# EAGLE schematic bottlenose (EAGLE 6.4)
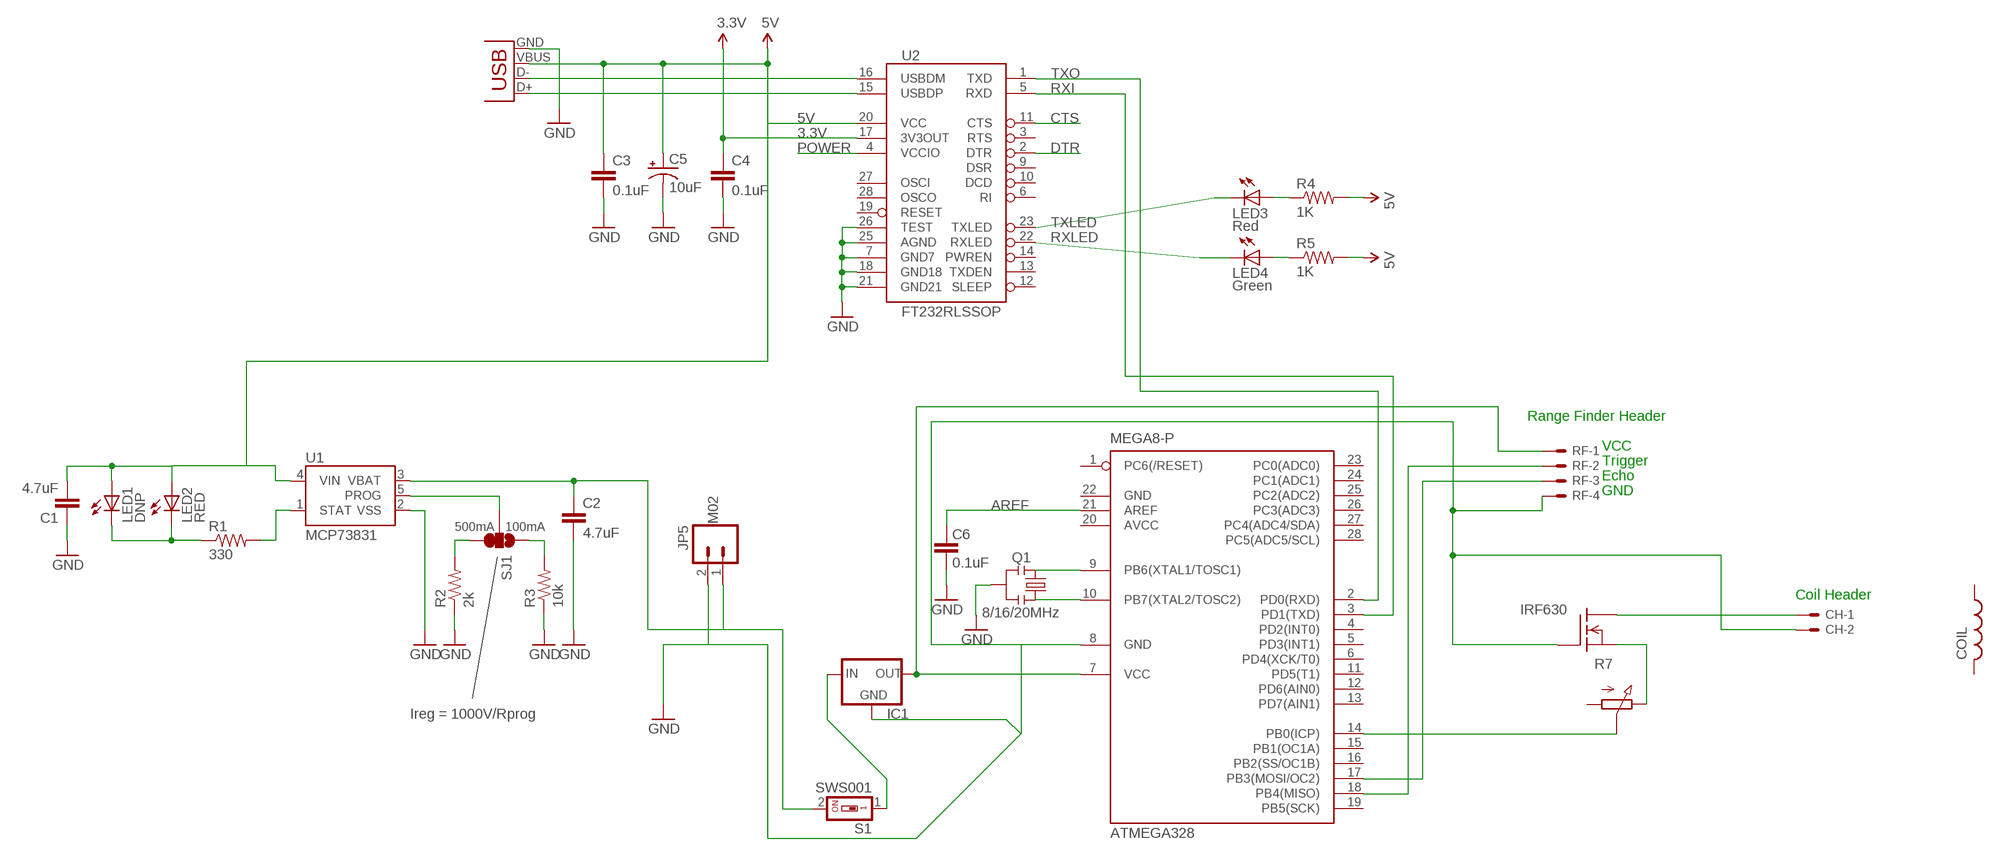
[diagram p0: schematic, sheet 1]

## Parts
ATMEGA328  MEGA8-P  [DIL28-3]
C1  4.7uF  CAP0402-CAP  [0402-CAP]
C2  4.7uF  CAP0402-CAP  [0402-CAP]
C3  0.1uF  CAP0402-CAP  [0402-CAP]
C4  0.1uF  CAP0402-CAP  [0402-CAP]
C5  10uF  CAP_POL1206  [EIA3216]
C6  0.1uF  CAP0402-CAP  [0402-CAP]
CH  22-23-2021  [22-23-2021]
COIL  L-US0204/7  [0204/7]
IC1  78LXX  [78LXX]
IRF630  IRF620  [TO220]
JP5  M02  M02PTH  [1X02]
LED1  DNP  LED3MM  [LED3MM]
LED2  RED  LED0603  [LED-0603]
LED3  Red  LED0603  [LED-0603]
LED4  Green  LED0603  [LED-0603]
Q1  8/16/20MHz  RESONATORSMD  [RESONATOR-SMD]
R1  330  RESISTOR0402-RES  [0402-RES]
R2  2k  RESISTOR0402-RES  [0402-RES]
R3  10k  RESISTOR0402-RES  [0402-RES]
R4  1K  RESISTOR0402-RES  [0402-RES]
R5  1K  RESISTOR0402-RES  [0402-RES]
R7  PC25  [PC25]
RF  22-23-2041  [22-23-2041]
S1  SWS001  [SMS-001]
SJ1  SOLDERJUMPER_2WAYS  [SJ_3]
U1  MCP73831  [SOT23-5]
U2  FT232RLSSOP  [SSOP28DB]
X1  USB-SMD-NS  [USB-MINIB-NOSTOP]

## Nets
3.3V [power]: C4.1 U2.17(3V3OUT)
5V: C1.2 C3.1 C5.A(+) LED1.A LED2.A R4.2 R5.2 U1.4(VIN) U2.20(VCC) X1.VBUS
AREF: ATMEGA328.21(AREF) C6.2
CTS: U2.11(CTS)
DTR: U2.2(DTR)
GND: ATMEGA328.8(GND) C1.1 C2.2 C3.2 C4.2 C5.C(-) C6.1 CH.2 IC1.GND IRF630.1(G) JP5.2 Q1.2 R2.1 R3.1 RF.4 U1.2(VSS) U2.7(GND7) U2.18(GND18) U2.21(GND21) U2.25(AGND) U2.26(TEST) X1.GND
N$1: IRF630.3(S) R7.E
N$2: R1.2 U1.1(STAT)
N$3: LED1.K(C) LED2.C R1.1
N$4: R2.2 SJ1.3
N$5: IC1.IN S1.1
N$7: R3.2 SJ1.1
N$8: ATMEGA328.17(PB3(MOSI/OC2)) RF.3
N$9: ATMEGA328.18(PB4(MISO)) RF.2
N$10: ATMEGA328.14(PB0(ICP)) R7.S
N$11: CH.1 IRF630.2(D)
N$12: ATMEGA328.10(PB7(XTAL2/TOSC2)) Q1.1
N$13: ATMEGA328.9(PB6(XTAL1/TOSC1)) Q1.3
N$15: LED3.A R4.1
N$16: LED4.A R5.1
N$35: ATMEGA328.7(VCC) IC1.OUT RF.1
POWER: U2.4(VCCIO)
PROG: SJ1.2 U1.5(PROG)
RXI: ATMEGA328.3(PD1(TXD)) U2.5(RXD)
RXLED: LED4.C U2.22(RXLED)
TXLED: LED3.C U2.23(TXLED)
TXO: ATMEGA328.2(PD0(RXD)) U2.1(TXD)
USB_D+: U2.15(USBDP) X1.D+
USB_D-: U2.16(USBDM) X1.D-
VBAT: C2.1 JP5.1 S1.2 U1.3(VBAT)
Unconnected: ATMEGA328.1(PC6(/RESET)) ATMEGA328.4(PD2(INT0)) ATMEGA328.5(PD3(INT1)) ATMEGA328.6(PD4(XCK/T0)) ATMEGA328.11(PD5(T1)) ATMEGA328.12(PD6(AIN0)) ATMEGA328.13(PD7(AIN1)) ATMEGA328.15(PB1(OC1A)) ATMEGA328.16(PB2(SS/OC1B)) ATMEGA328.19(PB5(SCK)) ATMEGA328.23(PC0(ADC0)) ATMEGA328.24(PC1(ADC1)) ATMEGA328.25(PC2(ADC2)) ATMEGA328.26(PC3(ADC3)) ATMEGA328.27(PC4(ADC4/SDA)) ATMEGA328.28(PC5(ADC5/SCL)) COIL.1 COIL.2 R7.A U2.3(RTS) U2.6(RI) U2.9(DSR) U2.10(DCD) U2.12(SLEEP) U2.13(TXDEN) U2.14(PWREN) U2.19(RESET) U2.27(OSCI) U2.28(OSCO)

## Notes on the sheet
- Range Finder Header
- VCC
- Trigger
- Echo
- GND
- 500mA | 100mA
- Coil Header
- Ireg = 1000V/Rprog

## Power pins joined to a net without a drawn wire
AVCC: ATMEGA328.20(AVCC)
GND: ATMEGA328.22(GND)

## Library data of the parts
ATMEGA328 = atmel:MEGA8-P: MICROCONTROLLER 8 Kbytes FLASH, 1 kbytes SRAM, 512 bytes EEPROM, USART, 4-channel 10 bit ADC, 2-channel 8 bit ADC Pin compatible with Atmega48, ATMega88, ATMega168 Source: avr.lbr; OC_FARNELL: unknown; OC_NEWARK: unknown
C1-C4 C6 = SparkFun:CAP: Capacitor Standard 0603 ceramic capacitor, and 0.1" leaded capacitor.
C5 = SparkFun:CAP_POL: Capacitor Polarized These are standard SMD and PTH capacitors. Normally 10uF, 47uF, and 100uF in electrolytic and tantalum varieties. Always verify the external diameter of the through hole cap, it varies with capacity, voltage, and manufacturer. The EIA devices should be standard.
CH = con-molex:22-23-2021: .100" (2.54mm) Center Header - 2 Pin; MF: MOLEX; MPN: 22-23-2021; OC_FARNELL: 1462926; OC_NEWARK: 25C3832
COIL = rcl:L-US: INDUCTOR, American symbol
IC1 = v-reg:78LXX: VOLTAGE REGULATOR
IRF630 = transistor-fet:IRF620: N-Channel Enhancement MOSFET (HEXFET); 200V; 5,2A; 0,8Ohm
JP5 = SparkFun:M02: Header 2 Standard 2-pin 0.1" header. Use with straight break away headers (SKU : PRT-00116), right angle break away headers (PRT-00553), swiss pins (PRT-00743), machine pins (PRT-00117), and female headers (PRT-00115). Molex polarized connector foot print use with SKU : PRT-08233 with associated crimp pins and housings.
LED1-LED4 = SparkFun:LED: LEDs Standard schematic elements and footprints for 5mm, 3mm, 1206, and 0603 sized LEDs. 5mm - Spark Fun Electronics SKU : COM-00529 (and others)
Q1 = SparkFun:RESONATOR: Resonator Small SMD resonator. This is the itty bitty 10/20MHz resonators with built in caps. CSTCE10M0G55 and CSTCE20M0V53. Footprint has been reviewed closely but hasn't been tested yet.
R1-R5 = SparkFun:RESISTOR: Resistor Basic schematic elements and footprints for 0603, 1206, and PTH resistors.
R7 = pot-vitrohm:PC25: VITROHM POTENTIOMETER; MF: CLAROSTAT; MPN: 308NPC25KS; OC_FARNELL: 1440998; OC_NEWARK: 03F7518
RF = con-molex:22-23-2041: .100" (2.54mm) Center Header - 4 Pin; MF: MOLEX; MPN: 22-23-2041; OC_FARNELL: 1462920; OC_NEWARK: 38C0355
S1 = smd-special:SWS001: SMD Dip Switch 1 pol.
SJ1 = SparkFun:SOLDERJUMPER_2WAY: Solder Jumper 2 way solder jumper
U1 = SparkFun:MCP73831: Microchip's MCP73831 Miniature single cell, fully integrated Li-Ion, Li-polymer charge management controller http://ww1.microchip.com/downloads/en/DeviceDoc/21984a.pdf
U2 = SparkFun:FT232RL: USB UART FT232RL 4th Generation USB UART (USB <-> Serial) Controller. Spark Fun Electronics SKU : COM-00650
X1 = SparkFun:USB: USB Connectors USB-B-PTH is fully proven SKU : PRT-00139 USB-miniB is fully proven SKU : PRT-00587 USB-A-PCB is untested. USB-A-H is throughly reviewed, but untested. Spark Fun Electronics SKU : PRT-00437 USB-B-SMT is throughly reviewed, but untested. Needs silkscreen touching up. USB-A-S has not been used/tested USB-MB-H has not been used/tested

## Net classes
0 default: width 0.203 mm
1 power: width 0.254 mm